# EAGLE schematic abr (EAGLE 9.6.2)
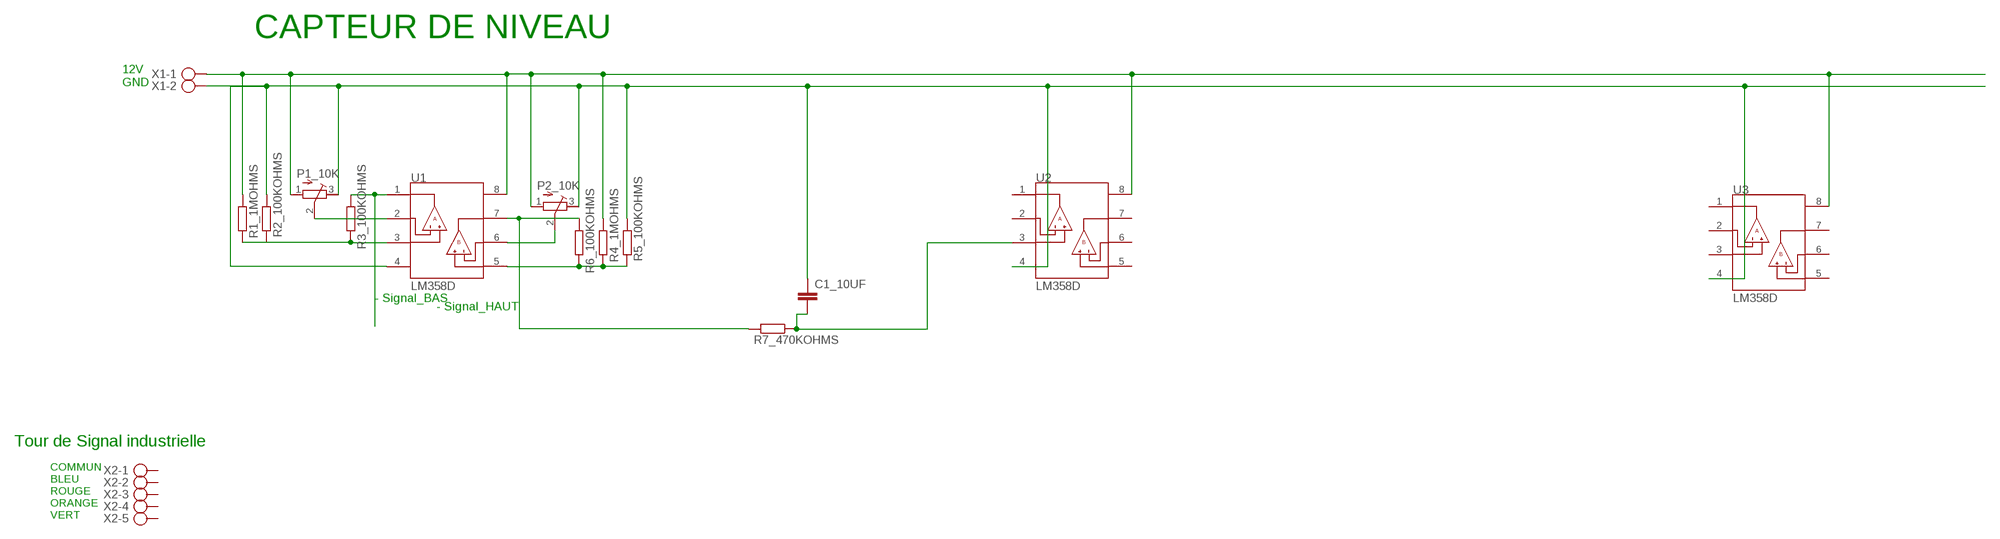
[diagram p0: schematic, sheet 1]

## Parts
C1_10UF  C-EU025-025X050  [C025-025X050]
P1_10K  R-TRIMM3339P  [RTRIM3339P]
P2_10K  R-TRIMM3339P  [RTRIM3339P]
R1_1MOHMS  R-EU_0207/10  [0207/10]
R2_100KOHMS  R-EU_0207/10  [0207/10]
R3_100KOHMS  R-EU_0207/10  [0207/10]
R4_1MOHMS  R-EU_0207/10  [0207/10]
R5_100KOHMS  R-EU_0207/10  [0207/10]
R6_100KOHMS  R-EU_0207/10  [0207/10]
R7_470KOHMS  R-EU_0207/10  [0207/10]
U1  LM358D  [SOIC127P599X175-8N]
U2  LM358D  [SOIC127P599X175-8N]
U3  LM358D  [SOIC127P599X175-8N]
X1  AK300/2  [AK300/2]
X2  AK300/5  [AK300/5]

## Nets
N$1: C1_10UF.2 R7_470KOHMS.1 U2.3(IN1+)
N$3: R1_1MOHMS.2 R2_100KOHMS.2 R3_100KOHMS.2 U1.3(IN1+)
N$4: P1_10K.2(S) U1.2(IN1-)
N$5: R3_100KOHMS.1 U1.1(OUT1)
N$6: P1_10K.1(A) P2_10K.1(A) R1_1MOHMS.1 R4_1MOHMS.1 U1.8(V+) U2.8(V+) U3.8(V+) X1.1
N$7: C1_10UF.1 P1_10K.3(E) P2_10K.3(E) R2_100KOHMS.1 R5_100KOHMS.1 U1.4(V-) U2.4(V-) U3.4(V-) X1.2
N$8: R4_1MOHMS.2 R5_100KOHMS.2 R6_100KOHMS.2 U1.5(IN2+)
N$9: R6_100KOHMS.1 R7_470KOHMS.2 U1.7(OUT2)
N$10: P2_10K.2(S) U1.6(IN2-)
Unconnected: U2.1(OUT1) U2.2(IN1-) U2.5(IN2+) U2.6(IN2-) U2.7(OUT2) U3.1(OUT1) U3.2(IN1-) U3.3(IN1+) U3.5(IN2+) U3.6(IN2-) U3.7(OUT2) X2.1 X2.2 X2.3 X2.4 X2.5

## Notes on the sheet
- CAPTEUR DE NIVEAU
- 12V
  GND
- - Signal_BAS | - Signal_HAUT
- Tour de Signal industrielle
- COMMUN
  BLEU
  ROUGE
  ORANGE
  VERT

## Library data of the parts
C1_10UF = rcl:C-EU: CAPACITOR, European symbol; SPICEPREFIX: C
P1_10K P2_10K = rcl:R-TRIMM: Trimm resistor; SPICEMODEL: X; SPICEPREFIXL: POT
R1_1MOHMS R2_100KOHMS R3_100KOHMS R4_1MOHMS R5_100KOHMS R6_100KOHMS R7_470KOHMS = rcl:R-EU_: RESISTOR, European symbol; SPICEPREFIX: R
U1-U3 = LM358D:LM358D: Check availability <https://pricing.snapeda.com/parts/LM358D/STMicroelectronics/view-part?ref=eda>; AVAILABILITY: In Stock; CHECK_PRICES: https://www.snapeda.com/parts/LM358D/STMicroelectronics/view-part/?ref=eda; DESCRIPTION: Op Amp Dual Low Power Amplifier ±15V/30V 8-Pin SO N Tube; MF: STMicroelectronics; MP: LM358D; PACKAGE: None; PRICE: None; SNAPEDA_LINK: https://www.snapeda.com/parts/LM358D/STMicroelectronics/view-part/?ref=snap
X1 = con-ptr500:AK300/2: CONNECTOR; OC_FARNELL: unknown; OC_NEWARK: unknown
X2 = con-ptr500:AK300/5: CONNECTOR; OC_FARNELL: unknown; OC_NEWARK: unknown